# Altium project PD.PrjPcb
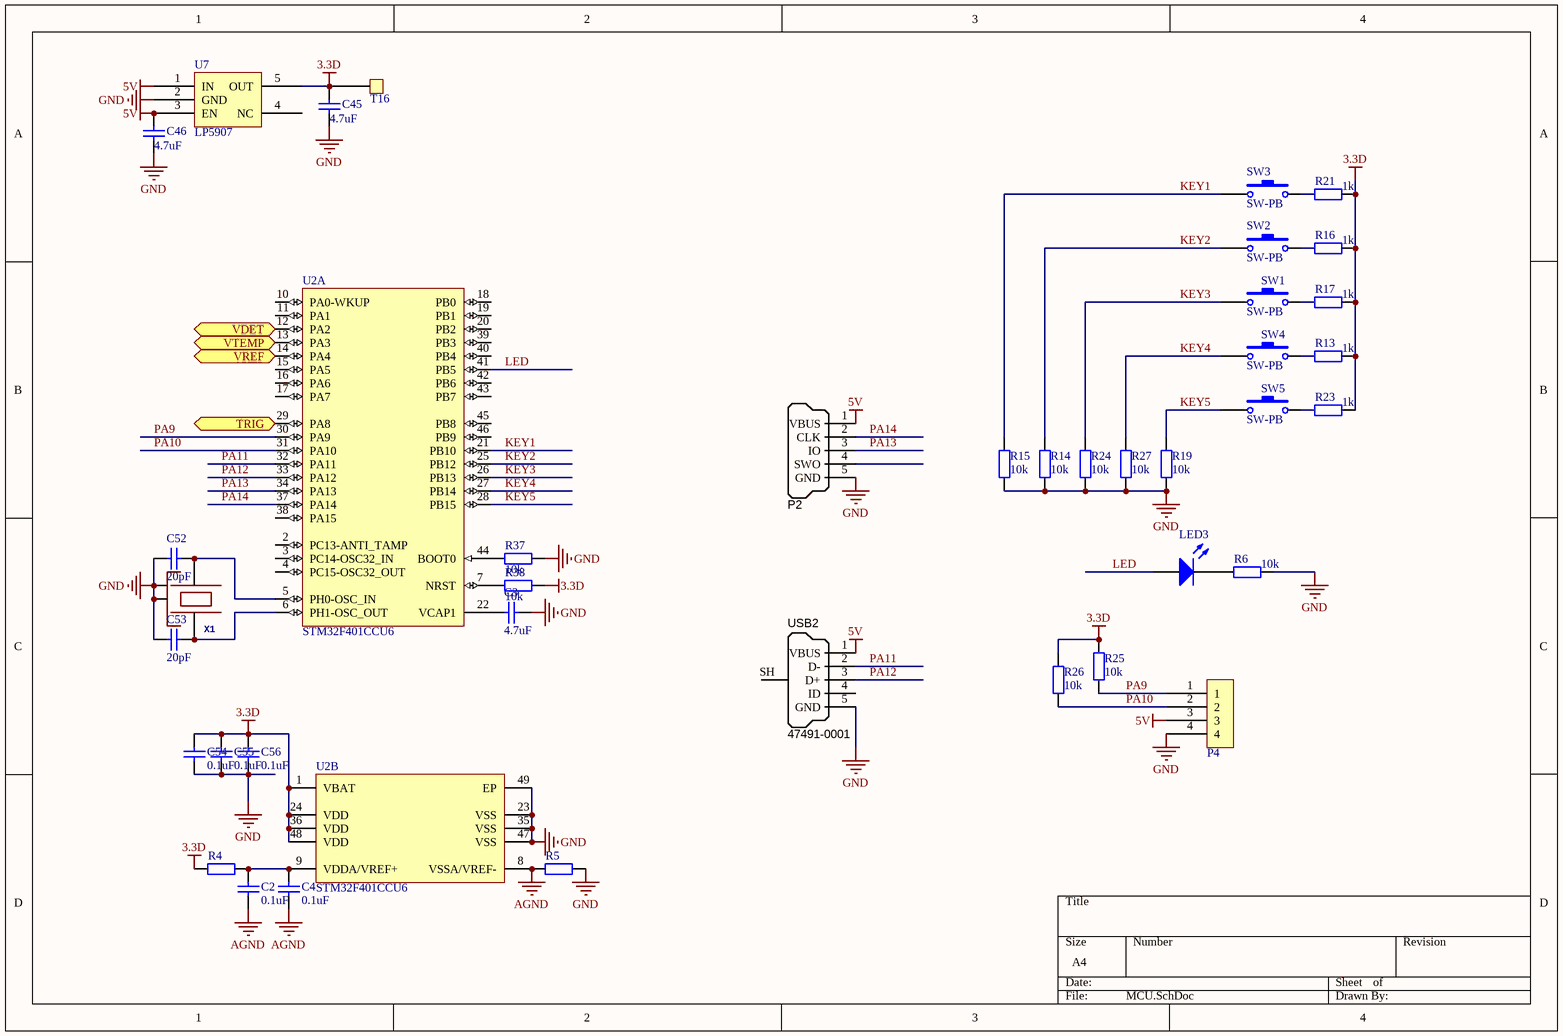
[diagram p0: MCU.SchDoc]
2 sheets, 65 parts. Net scope: flat (ports and power ports of the same name join across sheets).
Board file: PD.PcbDoc
Sheets:
  MCU.SchDoc
  Detector.SchDoc

## Sheet MCU.SchDoc
size A4

### Parts
C2  value 0.1uF  [0402]  (hidden comment: Cap)
C3  value 4.7uF  [0603]  (hidden comment: Cap)
C4  value 0.1uF  [0402]  (hidden comment: Cap)
C45  4.7uF  [0603]
C46  4.7uF  [0603]
C52  value 20pF  [0402]  (hidden comment: Cap)
C53  value 20pF  [0402]  (hidden comment: Cap)
C54  value 0.1uF  [0402]  (hidden comment: Cap)
C55  value 0.1uF  [0402]  (hidden comment: Cap)
C56  value 0.1uF  [0402]  (hidden comment: Cap)
LED3  LED0  [0603]  (value not drawn)
P2  SWD_MicroUSB  [MICRO-YZX]  (value not drawn)
P4  UART/I2C  [4pSocket]  (value not drawn)
R4  0R/FB  [0402]  (value not drawn)
R5  0R/FB  [0402]  (value not drawn)
R6  10k  [0402]
R13  1k  [0402]
R14  10k  [0402]
R15  10k  [0402]
R16  1k  [0402]
R17  1k  [0402]
R19  10k  [0402]
R21  1k  [0402]
R23  1k  [0402]
R24  10k  [0402]
R25  10k  [0402]
R26  10k  [0402]
R27  10k  [0402]
R37  value 10k  [0402]  (hidden comment: Res2)
R38  value 10k  [0402]  (hidden comment: Res2)
SW1  SW-PB  [SW3x4]
SW2  SW-PB  [SW3x4]
SW3  SW-PB  [SW3x4]
SW4  SW-PB  [SW3x4]
SW5  SW-PB  [SW3x4]
T16  TestPad  [TestPad - 1mm]  (value not drawn)
U2  STM32F401CCU6  [STM-UFQFPN48_N]  (parts A,B of 2)
U7  LP5907  [SOT23-5]
USB2  Manufacturer Part Number 1: 47491-0001  [MICRO-YZX]  (hidden comment: USB Micro Type B)
X1  24.000 KHz 3.2x2.5mm 8-10pf  [OSCILLATOR-3.2X2.5]  (value not drawn)

### Ports
TRIG, VDET, VREF, VTEMP

### Nets
3.3D: C45.2 C54.2 C55.2 C56.2 R4.2 R13.2 R16.2 R17.2 R21.2 R23.2 R25.2 R26.2 R38.1 T16.1 U2.1(VBAT) U2.24(VDD) U2.36(VDD) U2.48(VDD) U7.5(OUT)
5V: C46.2 P2.1(VBUS) P4.3 U7.1(IN) U7.3(EN) USB2.1(VBUS)
AGND: C2.1 C4.1 R5.2 U2.8(VSSA/VREF-)
GND: C3.1 C45.1 C46.1 C52.1 C53.1 C54.1 C55.1 C56.1 P2.5(GND) P4.4 R5.1 R6.2 R14.1 R15.1 R19.1 R24.1 R27.1 R37.2 U2.23(VSS) U2.35(VSS) U2.47(VSS) U2.49(EP) U7.2(GND) USB2.5(GND) X1.2(NC_2) X1.4(NC_4)
KEY1: R15.2 SW3.1 U2.21(PB10)
KEY2: R14.2 SW2.1 U2.25(PB12)
KEY3: R24.2 SW1.1 U2.26(PB13)
KEY4: R27.2 SW4.1 U2.27(PB14)
KEY5: R19.2 SW5.1 U2.28(PB15)
LED: LED3.1(A) U2.41(PB5)
PA9: P4.1 R25.1 U2.30(PA9)
PA10: P4.2 R26.1 U2.31(PA10)
PA11: U2.32(PA11) USB2.2(D-)
PA12: U2.33(PA12) USB2.3(D+)
PA13: P2.3(IO) U2.34(PA13)
PA14: P2.2(CLK) U2.37(PA14)
VOUT: U2.12(PA2) ; port VDET
NetC2_2: C2.2 C4.2 R4.1 U2.9(VDDA/VREF+)
NetC3_2: C3.2 U2.22(VCAP1)
NetC52_2: C52.2 U2.5(PH0-OSC_IN) X1.1
NetC53_2: C53.2 U2.6(PH1-OSC_OUT) X1.3
NetLED3_2: LED3.2(K) R6.1
NetR3_1: U2.14(PA4) ; port VREF
NetR13_1: R13.1 SW4.2
NetR16_1: R16.1 SW2.2
NetR17_1: R17.1 SW1.2
NetR21_1: R21.1 SW3.2
NetR23_1: R23.1 SW5.2
NetR34_1: U2.29(PA8) ; port TRIG
NetR37_1: R37.1 U2.44(BOOT0)
NetR38_2: R38.2 U2.7(NRST)
NetT18_1: U2.13(PA3) ; port VTEMP

Not connected (* = marked no-connect by the designer): P2 4(SWO); U2 2(PC13-ANTI_TAMP) 3(PC14-OSC32_IN) 4(PC15-OSC32_OUT) 10(PA0-WKUP) 11(PA1) 15(PA5) 16(PA6) 17(PA7) 18(PB0) 19(PB1) 20(PB2) 38(PA15) 39(PB3) 40(PB4) 42(PB6) 43(PB7) 45(PB8) 46(PB9); U7 4(NC); USB2 4(ID) SH(Shell)

### Library data of the parts
C2-C4 C45 C46 C52-C56 = Cap: Capacitor; Published: 8-Jun-2000; LatestRevisionDate: 17-Jul-2002; LatestRevisionNote: Re-released for DXP Platform.; PackageReference: RAD-0.3; Publisher: Altium Limited; PackageDescription: Radial Cap, Thru-Hole; 2 Leads; 0.3 in Pin Spacing
LED3 = LED0: Typical INFRARED GaAs LED; Published: 8-Jun-2000; LatestRevisionDate: 08-Jul-2005; LatestRevisionNote: Mech Layer 1 removed.; PackageReference: LED-0; Publisher: Altium Limited; PackageDescription: LED; 2 Leads
P2 = SWD_MicroUSB: Connector SMD USB Micro Type B middle mount; Manufacturer 1: Molex Inc; SCDType: undef; Package / Case: SMD; Supplier 1: Digi-Key; Supplier Part Number 1: WM17142CT-ND
P4 = 4PSocket
R4 R5 R37 R38 = Res2: Resistor; Published: 8-Jun-2000; LatestRevisionDate: 17-Jul-2002; LatestRevisionNote: Re-released for DXP Platform.; PackageReference: AXIAL-0.4; Publisher: Altium Limited; PackageDescription: Axial Device, Thru-Hole; 2 Leads; 0.4 in Pin Spacing
R6 R13-R17 R19 R21 R23-R27 = Res2: Resistor; Value: 0Ohm; Published: 8-Jun-2000; LatestRevisionDate: 17-Jul-2002; LatestRevisionNote: Re-released for DXP Platform.; PackageReference: AXIAL-0.4; Publisher: Altium Limited; PackageDescription: Axial Device, Thru-Hole; 2 Leads; 0.4 in Pin Spacing
SW1-SW5 = SW-PB: Switch; Published: 24-Mar-1999; LatestRevisionDate: 17-Jul-2002; LatestRevisionNote: Re-released for DXP Platform.; PackageReference: SPST-2; Publisher: Altium Limited; PackageDescription: Switch; 2 Leads
U2 = STM32F401CCU6: ARM Cortex-M4 32-bit MCU+FPU, 105 DMIPS, 256 kB Flash, 64 kB Internal RAM, 36 I/Os, 48-pin UFQFPN, -40 to 85 degC, Tray; Manufacturer: STMicroelectronics; FLASH Size (Prog) (kB): 256; I/Os (High Current): 36; Internal RAM Size (kB): 64; Operating Frequency(F) (Processor speed) (MHz): 84; Supply Voltage(Vcc) max (V): 3.6; Supply Voltage(Vcc) min (V): 1.8; DatasheetVersion: Rev. 1; PackageVersion: Rev. 1, 04/2013; PackageReference: UFQFPN48; PackageDescription: 48-Pin Ultra Thin Fine Pitch Quad Flat No-Lead, 7 x 7 x 0.6 mm Body, 0.5 mm Pitch, Exposed Pad; Supplier 1: Newark; Supplier Part Number 1: 19X6217; Supplier 2: Mouser; Supplier Part Number 2: 511-STM32F401CCU6; Core: ARM Cortex-M4; Packing: Tray; Mounting Technology: Surface Mount; PartNumber: STM32F401CCU6; ComponentLink1Description: Manufacturer URL; ComponentLink1URL: http://www.st.com/web/en/home.html; ComponentLink2Description: Datasheet; ComponentLink2URL: http://www.st.com/st-web-ui/static/active/en/resource/technical/document/data_brief/DM00071938.pdf; ComponentLink3Description: Package Specification; ComponentLink3URL: http://www.st.com/st-web-ui/static/active/en/resource/technical/document/data_brief/DM00071938.pdf
USB2 = USB_Micro_TypeB: Connector SMD USB Micro Type B middle mount; Manufacturer 1: Molex Inc; SCDType: undef; Package / Case: SMD; Supplier 1: Digi-Key; Supplier Part Number 1: WM17142CT-ND
X1 = OSCILLATOR-3.2X2.5: Crystal Oscillator in 3.2x2.5 SMD

## Sheet Detector.SchDoc
size A4
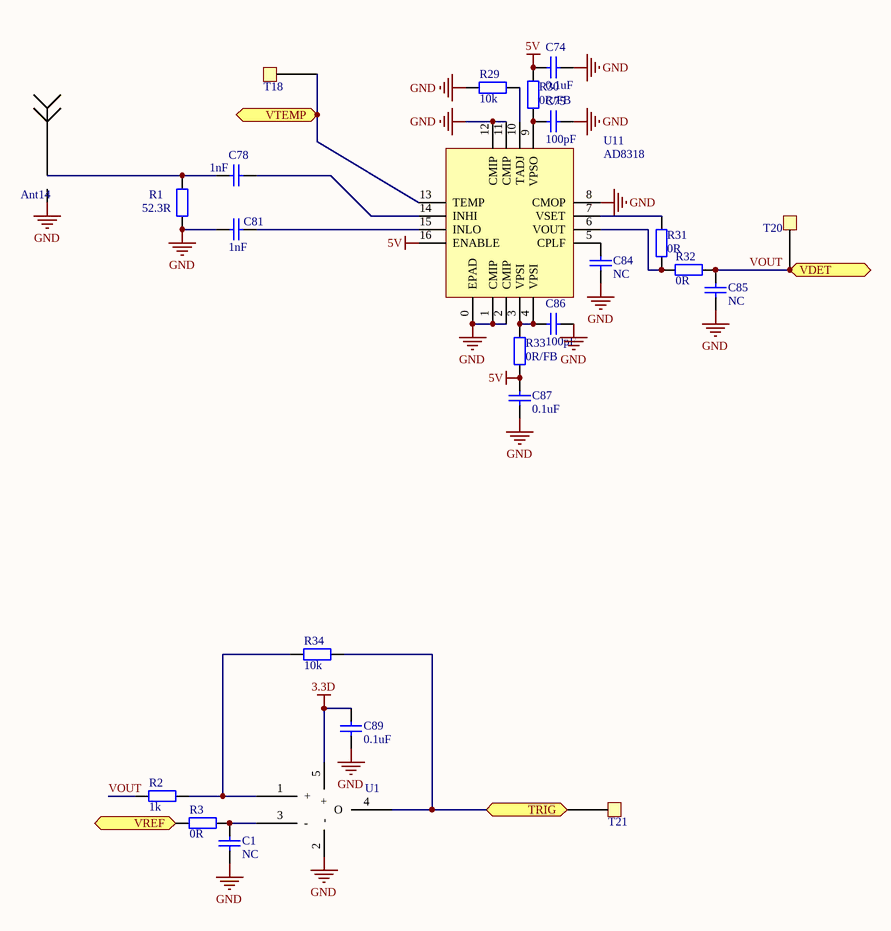
[diagram p1: Detector.SchDoc]

### Parts
Ant14  Antenna  [SMA-2]  (value not drawn)
C1  value NC  [0402]  (hidden comment: Cap)
C74  value 0.1uF  [0402]  (hidden comment: Cap)
C75  value 100pF  [0402]  (hidden comment: Cap)
C78  value 1nF  [0402]  (hidden comment: Cap)
C81  value 1nF  [0402]  (hidden comment: Cap)
C84  value NC  [0402]  (hidden comment: Cap)
C85  value NC  [0402]  (hidden comment: Cap)
C86  value 100pF  [0402]  (hidden comment: Cap)
C87  value 0.1uF  [0402]  (hidden comment: Cap)
C89  value 0.1uF  [0402]  (hidden comment: Cap)
R1  value 52.3R  [0402]  (hidden comment: Res2)
R2  value 1k  [0402]  (hidden comment: Res2)
R3  value 0R  [0402]  (hidden comment: Res2)
R29  value 10k  [0402]  (hidden comment: Res2)
R30  value 0R/FB  [0402]  (hidden comment: Res2)
R31  value 0R  [0402]  (hidden comment: Res2)
R32  value 0R  [0402]  (hidden comment: Res2)
R33  value 0R/FB  [0402]  (hidden comment: Res2)
R34  value 10k  [0402]  (hidden comment: Res2)
T18  TestPad  [TestPad - 1mm]  (value not drawn)
T20  TestPad  [TestPad - 1mm]  (value not drawn)
T21  TestPad  [TestPad - 1mm]  (value not drawn)
U1  OP-SOT23  [SOT23-5]  (value not drawn)
U11  AD8318  [AD8318]

### Ports
TRIG, VDET, VREF, VTEMP

### Nets
3.3D: C89.2 U1.5(+)
5V: C74.2 C87.2 R30.1 R33.2 U11.16(ENABLE)
GND: Ant14.GND(G) C1.2 C74.1 C75.1 C81.2 C84.2 C85.2 C86.1 C87.1 C89.1 R1.2 R29.1 U1.2(-) U11.0(EPAD) U11.1(CMIP) U11.2(CMIP) U11.8(CMOP) U11.11(CMIP) U11.12(CMIP)
VOUT: C85.1 R2.2 R32.2 T20.1 ; port VDET
NetAnt14_1: Ant14.1 C78.2 R1.1
NetC1_1: C1.1 R3.2 U1.3(-)
NetC75_2: C75.2 R30.2 U11.9(VPSO)
NetC78_1: C78.1 U11.14(INHI)
NetC81_1: C81.1 U11.15(INLO)
NetC84_1: C84.1 U11.5(CPLF)
NetC86_2: C86.2 R33.1 U11.3(VPSI) U11.4(VPSI)
NetR2_1: R2.1 R34.2 U1.1(+)
NetR3_1: R3.1 ; port VREF
NetR29_2: R29.2 U11.10(TADJ)
NetR31_1: R31.1 U11.7(VSET)
NetR31_2: R31.2 R32.1 U11.6(VOUT)
NetR34_1: R34.1 T21.1 U1.4(O) ; port TRIG
NetT18_1: T18.1 U11.13(TEMP) ; port VTEMP

### Library data of the parts
C1 C74 C75 C78 C81 C84-C87 C89 = Cap: Capacitor; Published: 8-Jun-2000; LatestRevisionDate: 17-Jul-2002; LatestRevisionNote: Re-released for DXP Platform.; PackageReference: RAD-0.3; Publisher: Altium Limited; PackageDescription: Radial Cap, Thru-Hole; 2 Leads; 0.3 in Pin Spacing
R1-R3 R29-R34 = Res2: Resistor; Published: 8-Jun-2000; LatestRevisionDate: 17-Jul-2002; LatestRevisionNote: Re-released for DXP Platform.; PackageReference: AXIAL-0.4; Publisher: Altium Limited; PackageDescription: Axial Device, Thru-Hole; 2 Leads; 0.4 in Pin Spacing

## Nets that join several sheets
3.3D: MCU (19 pins), Detector (C89.2 U1.5)
5V: MCU (6 pins), Detector (5 pins)
GND: MCU (26 pins), Detector (19 pins)
NetR3_1: MCU (U2.14), Detector (R3.1)
NetR34_1: MCU (U2.29), Detector (R34.1 T21.1 U1.4)
NetT18_1: MCU (U2.13), Detector (T18.1 U11.13)
VOUT: MCU (U2.12), Detector (C85.1 R2.2 R32.2 T20.1)